# EasyEDA Pro project OctoSlime_TouchPad_Led_Mount.eprj

# Schematic Schematic1
Create Date: 2022-09-05; Page Name: P1; Project Name: OctoSlime_TouchPad_Led_Mount; Schematic Name: Schematic1; Update Date: 2022-09-05
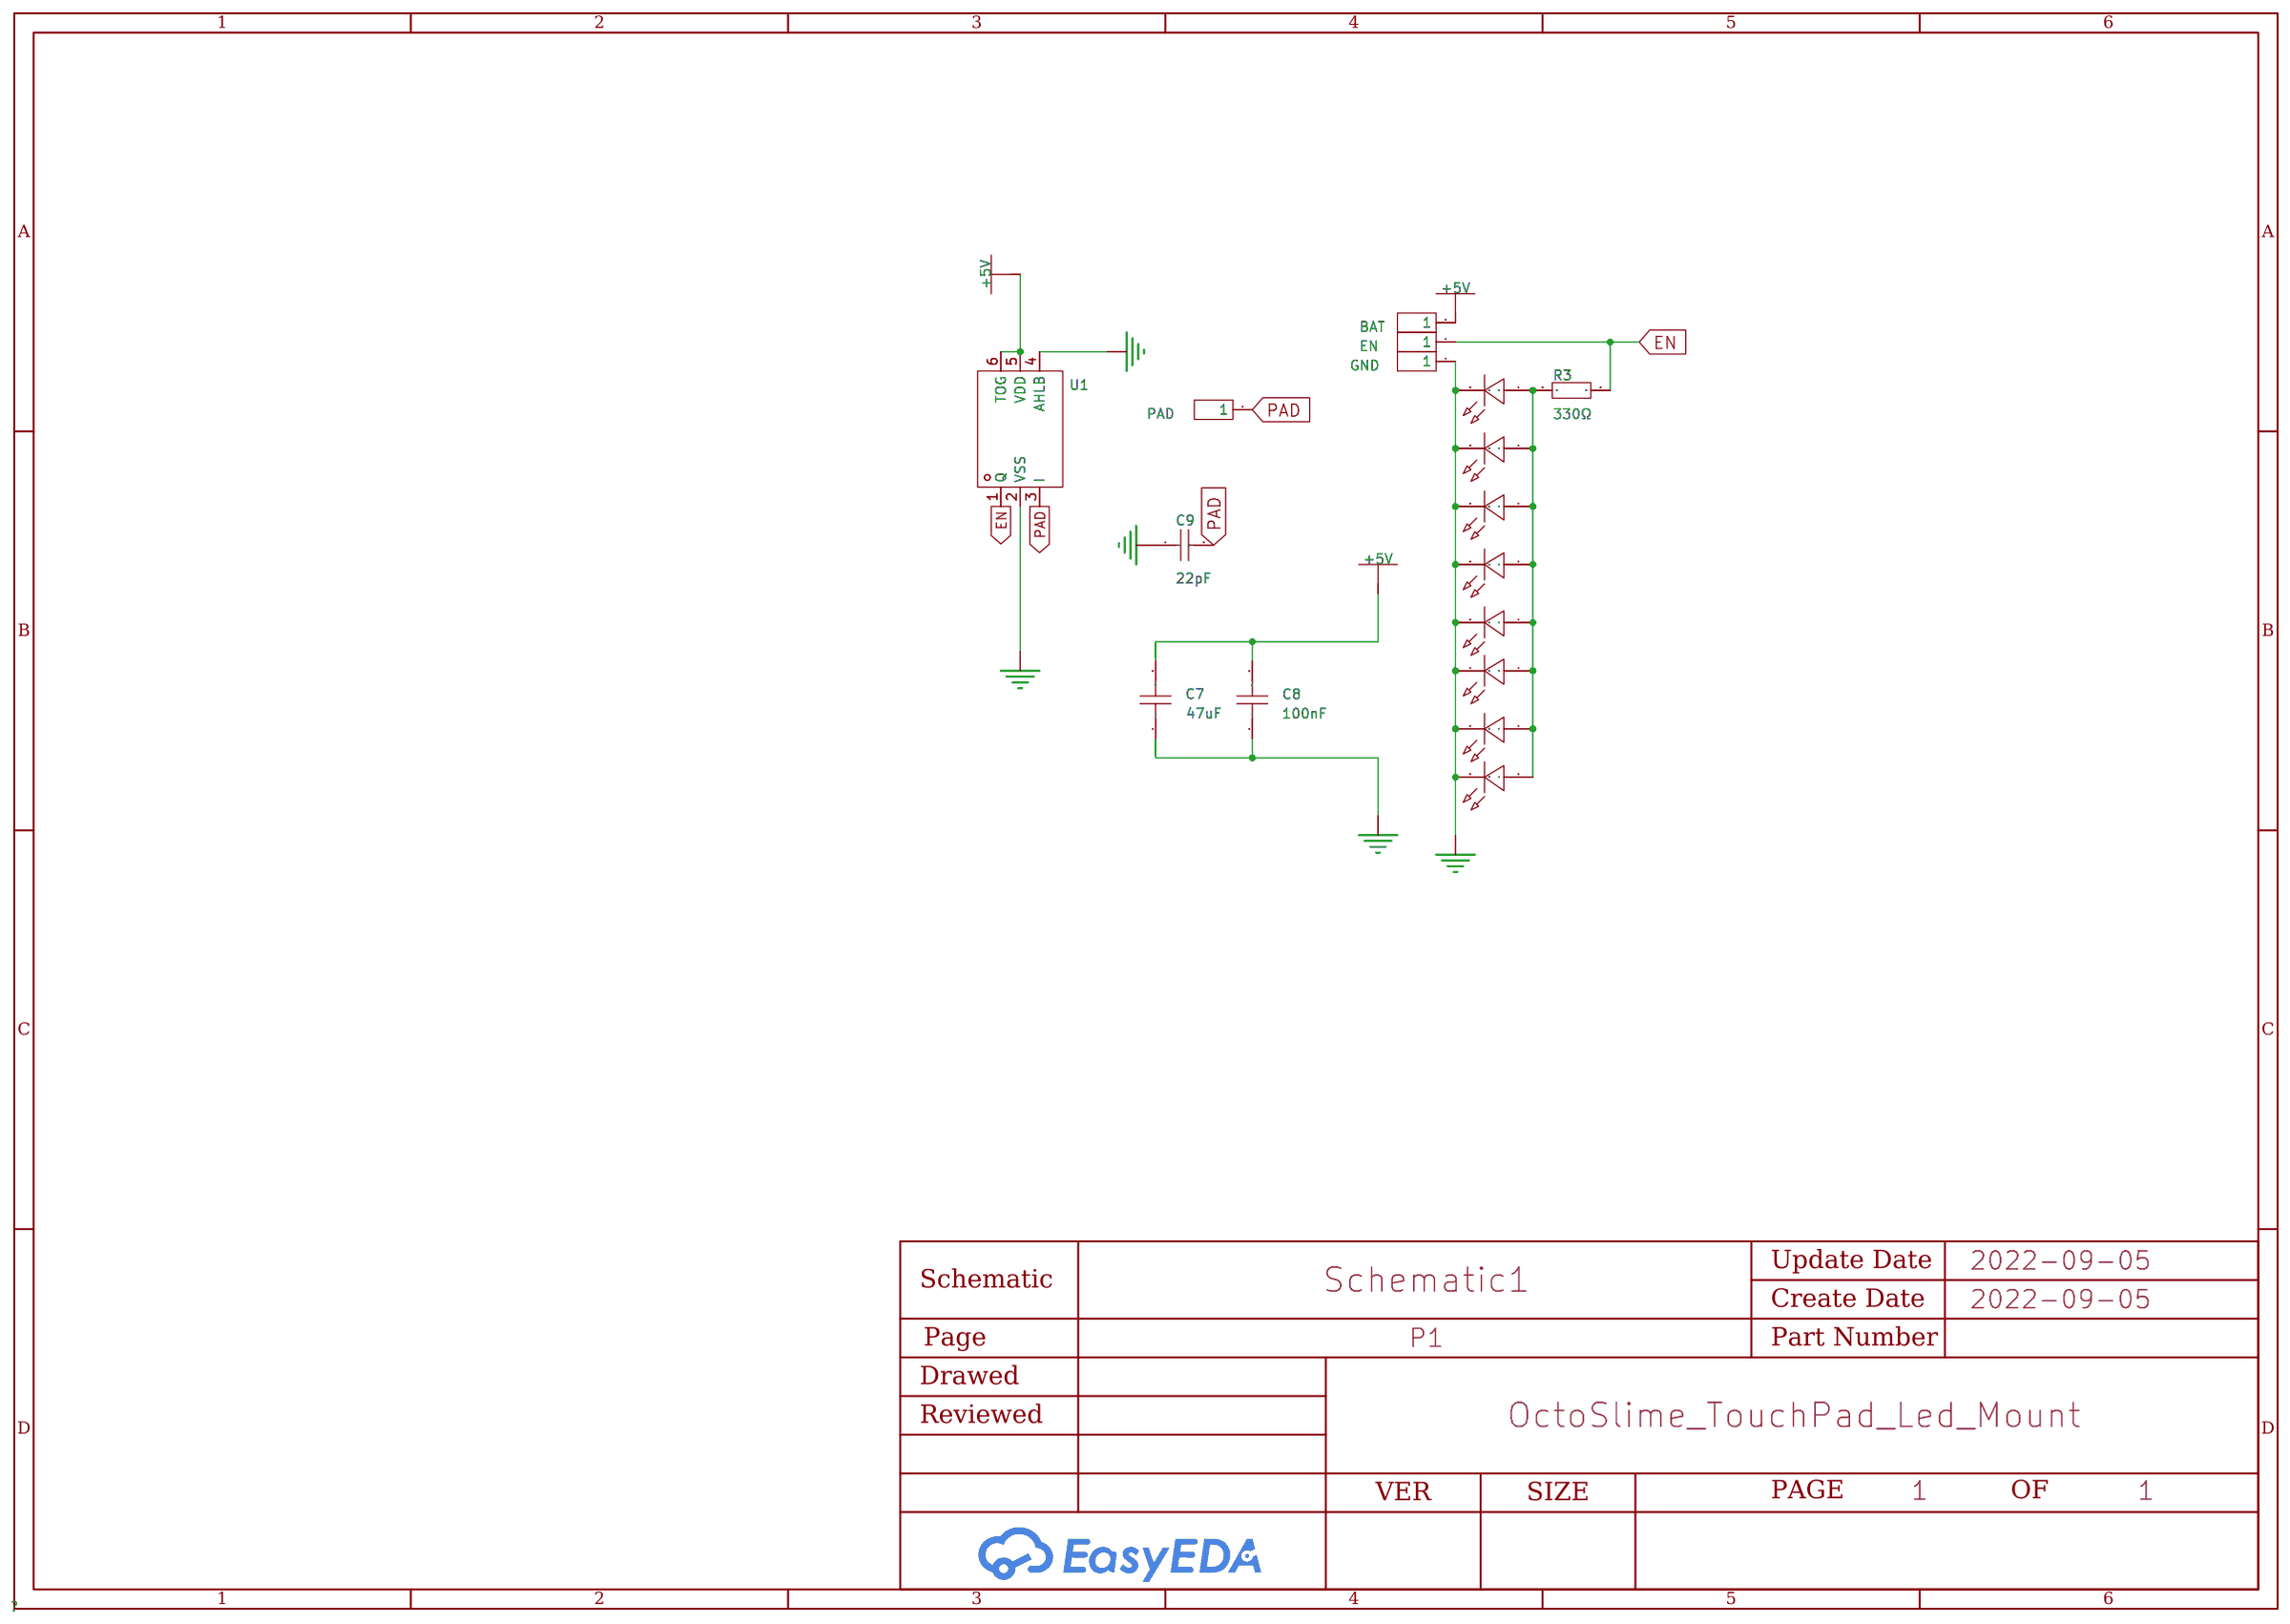
[diagram p0: schematic sheet]

## Parts
BAT  -  [HDR-TH_1P-P2.54-V-M]  (no BOM)
C7  47uF  [C1206]
C8  100nF  [C0402]
C9  22pF  [C0805]
EN  -  [HDR-TH_1P-P2.54-V-M]  (no BOM)
GND  -  [HDR-TH_1P-P2.54-V-M]  (no BOM)
LED5  LED-0805_B  [LED0805_BLUE]
LED6  LED-0805_B  [LED0805_BLUE]
LED7  LED-0805_B  [LED0805_BLUE]
LED8  LED-0805_B  [LED0805_BLUE]
LED9  LED-0805_B  [LED0805_BLUE]
LED10  LED-0805_B  [LED0805_BLUE]
LED11  LED-0805_B  [LED0805_BLUE]
LED12  LED-0805_B  [LED0805_BLUE]
PAD  -  [HDR-TH_1P-P2.54-V-M]  (no BOM)
R3  330Ω  [R0805]
U1  -  [SOT-23-6_L2.9-W1.6-P0.95-LS2.8-BR]  (no BOM)

## Library data of the parts
BAT EN GND PAD = 2.54-1*1P针: 间距:-;总PIN位数:1;排数:1;插针结构:-;行距:-;安装类型:直插;圆针/方针:-;额定电流:-;额定电压:-;配合针长度:-;塑高:-;触头材质:-;触头镀层:-;颜色:黑色;; LCSC Part Name: 1x1P; Supplier Part: C81276; Manufacturer: BOOMELE(博穆精密); Supplier Footprint: 插件; JLCPCB Part Class: Extended Part; Supplier: LCSC; Number of Pins: 1; Number of Rows: 1; Mounting Type: 直插; Color: 黑色; LCSC On Sale: 1; JLCPCB On Sale: 1; Type: 直插; Connector Type: 排针
C7 = CL31A476MPHNNNE: 容值:47uF;精度:±20%;额定电压:10V;温度系数:X5R;; LCSC Part Name: 47uF ±20% 10V; Supplier Part: C96123; Manufacturer: SAMSUNG(三星); Supplier Footprint: 1206; JLCPCB Part Class: Basic Part; Datasheet: https://atta.szlcsc.com/upload/public/pdf/source/20170228/1488267692219.pdf; Supplier: LCSC; Tolerance: ±20%; Voltage Rated: 10V; Temperature Coefficient: X5R
C8 = CL05B104KB54PNC: 容值:100nF;精度:±10%;额定电压:50V;温度系数:X7R;; LCSC Part Name: 100nF ±10% 50V; Supplier Part: C307331; Manufacturer: SAMSUNG(三星); Supplier Footprint: 0402; JLCPCB Part Class: Basic Part; Datasheet: https://atta.szlcsc.com/upload/public/pdf/source/20181009/C307331_222F7C870FD3EA5F46F538B483443886.pdf; Supplier: LCSC; Tolerance: ±10%; Voltage Rated: 50V; Temperature Coefficient: X7R
C9 = CL21C220JBANNNC: 容值:22pF;精度:±5%;额定电压:50V;温度系数:C0G;; LCSC Part Name: 22pF ±5% 50V; Supplier Part: C1804; Manufacturer: SAMSUNG(三星); Supplier Footprint: 0805; JLCPCB Part Class: Basic Part; Datasheet: https://atta.szlcsc.com/upload/public/pdf/source/20160103/1457707697973.pdf; Supplier: LCSC; Tolerance: ±5%; Voltage Rated: 50V; Temperature Coefficient: C0G
LED5-LED12 = LED-0805_B: 3DModel: LED0805_Blue; Manufacturer: 方舟 ARKLED; Manufacturer Part: D-B080508B1-KS2; Supplier Part: C108412
R3 = 0805W8F3300T5E: 电阻类型:厚膜电阻;阻值:330Ω;精度:±1%;功率:125mW;温度系数:±100ppm/;最大工作电压:150V;工作温度范围:-55~+155;; LCSC Part Name: 330Ω ±1%; Supplier Part: C17630; Manufacturer: UNI-ROYAL(厚声); Supplier Footprint: 0805; JLCPCB Part Class: Basic Part; Datasheet: https://atta.szlcsc.com/upload/public/pdf/source/20200306/C422600_1E6D84923E4A46A82E41ADD87F860B5C.pdf; Supplier: LCSC; Type: 厚膜电阻; Tolerance: ±1%; Power(Watts): 125mW; Temperature Coefficient: ±100ppm/; Overload Voltage (Max): 150V; Operating Temperature Range: -55~+155
U1 = TTP223E-BA6: 单按键触摸感应开关; LCSC Part Name: TTP223E-BA6 停产; Supplier Part: C129457; Manufacturer: TONTEK(台湾通泰); Supplier Footprint: SOT-23-6; JLCPCB Part Class: Extended Part; Datasheet: https://atta.szlcsc.com/upload/public/pdf/source/20170914/C129457_1505360037116968239.pdf; Supplier: LCSC

## Nets
+5V: BAT.1 C7.2 C8.2 U1.5(VDD) U1.6(TOG)
GND: C7.1 C8.1 C9.1 GND.1 LED5.2 LED6.2 LED7.2 LED8.2 LED9.2 LED10.2 LED11.2 LED12.2 U1.2(VSS) U1.4(AHLB)
EN: EN.1 R3.1 U1.1(Q)
NET2: LED5.1 LED6.1 LED7.1 LED8.1 LED9.1 LED10.1 LED11.1 LED12.1 R3.2
PAD: C9.2 PAD.1 U1.3(I)

# Board PCB1
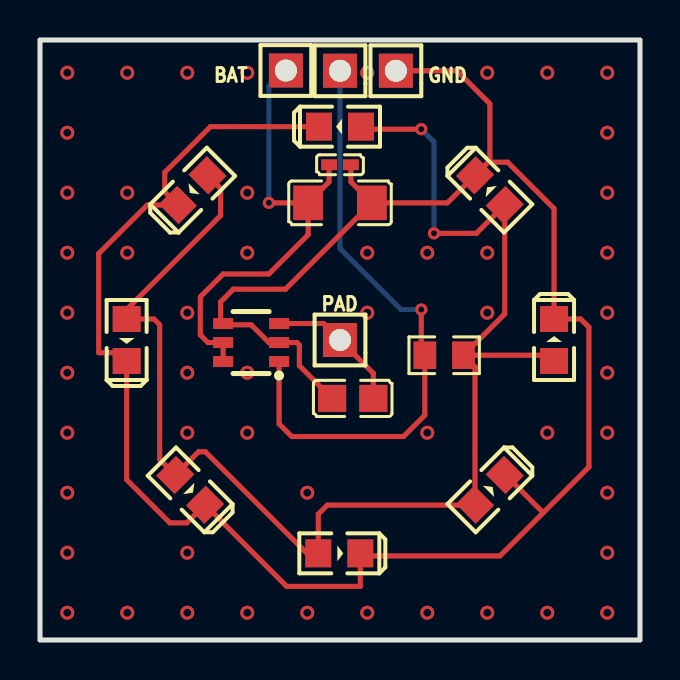
[diagram p1: board, top side]
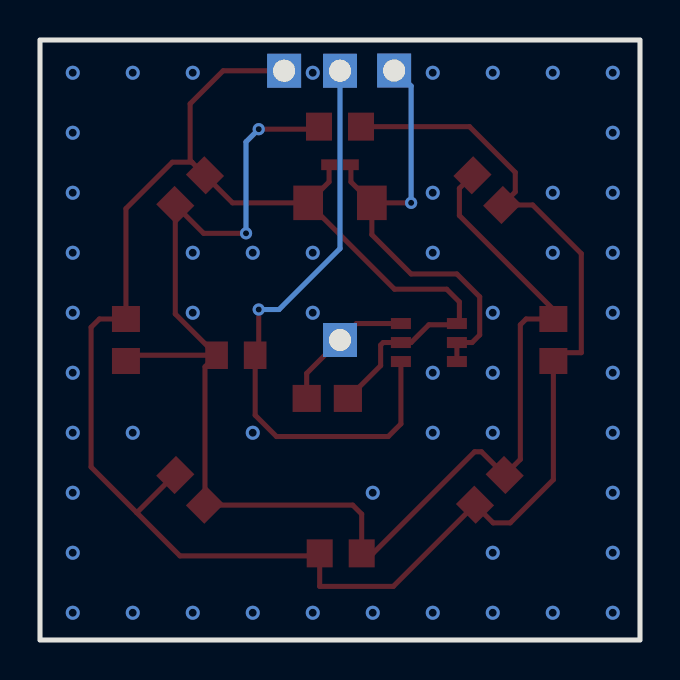
[diagram p2: board, bottom side, seen from below]

Outline 30 x 30 mm; copper layers: Top Layer, Bottom Layer. Coordinates in mm from the lower left corner of the outline.
Outline path: rectangle 0,30 30,0
Stack: Top Layer 0.035mm / Dielectric1 1.51mm FR4 er 4.5 / Bottom Layer 0.035mm

## Design rules (mm)
spacing safeClearance (default): track to track 0.152, other pairs 0.152 to 0.3
track width trackWidth (default): min 0.127, default 0.254, max 2.54
differential pair differentialPair (default): width min 0.127, default 0.254, max 2.54; gap min 0.152, default 0.152
via viaSize (default): diameter min 0.5, default 0.61, max 10; hole min 0.3, default 0.305, max 6

## Placement (name value [footprint] x y rotation side)
BAT  -  [HDR-TH_1P-P2.54-V-M]  12.29 28.47 0 top
C7  47uF  [C1206]  15 21.86 180 top
C8  100nF  [C0402]  15 23.76 180 top
C9  22pF  [C0805]  15.63 12.08 0 top
EN  -  [HDR-TH_1P-P2.54-V-M]  15 28.46 0 top
GND  -  [HDR-TH_1P-P2.54-V-M]  17.79 28.46 0 top
LED5  LED-0805_B  [LED0805_BLUE]  4.33 15 270 top
LED6  LED-0805_B  [LED0805_BLUE]  22.49 7.51 45 top
LED7  LED-0805_B  [LED0805_BLUE]  25.7 15 90 top
LED8  LED-0805_B  [LED0805_BLUE]  22.49 22.49 135 top
LED9  LED-0805_B  [LED0805_BLUE]  15 25.67 180 top
LED10  LED-0805_B  [LED0805_BLUE]  7.51 7.51 315 top
LED11  LED-0805_B  [LED0805_BLUE]  7.63 22.49 225 top
LED12  LED-0805_B  [LED0805_BLUE]  14.97 4.33 0 top
PAD  -  [HDR-TH_1P-P2.54-V-M]  15 15 0 top
R3  330Ω  [R0805]  20.21 14.24 0 top
U1  -  [SOT-23-6_L2.9-W1.6-P0.95-LS2.8-BR]  10.56 14.87 0 top

## Footprints (pads in the part's own frame, mm; a bottom-side part is the same pattern mirrored in y, then rotated)
C0402
  rect 0.79x0.541 smd: 1(-0.546,0) 2(0.546,0)
C0805
  rect 1.409x1.351 smd: 1(-1.028,0) 2(1.031,0)
C1206
  rect 1.486x1.727 smd: 1(-1.593,0) 2(1.593,0)
HDR-TH_1P-P2.54-V-M
  rect 1.7x1.7 hole 1.1: 1(0,0)
LED0805_BLUE
  rect 1.3x1.399 smd: 1(-1.05,0) 2(1.05,0)
R0805
  rect 1.133x1.377 smd: 1(-0.965,0) 2(0.965,0)
SOT-23-6_L2.9-W1.6-P0.95-LS2.8-BR
  rect 1.001x0.551 smd: 1(1.399,-0.95) 2(1.399,0) 3(1.399,0.95) 4(-1.399,0.95) 5(-1.399,0) 6(-1.399,-0.95)

## Nets
As in the schematic.

## Via types
v1: diameter 0.61, hole 0.305, Top Layer to Bottom Layer, 4 vias
v2: diameter 0.7, hole 0.4, Top Layer to Bottom Layer, 52 vias

## Routing (per net, layer and track width the routed paths; a pad name or vN(x,y) marks a point on that pad's centre or on a via; arc(x,y) is an arc through that point)
+5V: length 23.6
  Top Layer w0.254: v1(11.44,21.86) C7.2 ; C7.2 14.45,22.9 C8.2 ; C7.2 13.41,20.27 11.44,18.3 9.16,18.3 8.01,17.16 8.01,15.25 8.4,14.87 U1.5 U1.6
  Bottom Layer w0.254: 12.21,28.46 11.44,27.7 v1(11.44,21.86)
GND: length 114.7
  Top Layer w0.254: 25.16,6.36 27.45,8.65 27.45,15.64 27.03,16.05 LED7.2 25.7,21.57 23.38,23.89 22.4,23.89 ; 25.16,6.36 23,4.2 16.14,4.2 LED12.2 16.02,2.68 12.33,2.68 LED10.2 7.34,5.86 6.49,5.86 4.33,8.02 LED5.2 3.92,14.36 2.94,14.36 2.94,19.32 5.37,21.75 LED11.2 6.24,22.4 6.24,23.38 8.52,25.67 LED9.2 ; 25.16,6.36 23.27,8.25 LED6.2 ; C7.1 20.37,21.86 22.4,23.89 ; C7.1 15.55,22.9 C8.1 ; C7.1 12.27,17.54 9.67,17.54 9.03,16.91 9.03,15.95 9.22,15.76 10.56,15.76 11.44,14.87 U1.2 12.84,14.87 12.97,14.75 12.97,13.72 C9.1 ; 22.4,23.89 22.49,23.98 22.49,26.81 20.84,28.46 GND.1
  vias: v2(1.36,28.36) v2(1.36,25.36) v2(1.36,22.36) v2(1.36,19.36) v2(1.36,16.36) v2(1.36,13.36) v2(1.36,10.36) v2(1.36,7.36) v2(1.36,4.36) v2(1.36,1.36) v2(4.36,28.36) v2(4.36,22.36) v2(4.36,19.36) v2(4.36,1.36) v2(7.36,28.36) v2(7.36,16.36) v2(7.36,13.36) v2(7.36,10.36) v2(7.36,4.36) v2(7.36,1.36) v2(10.36,28.36) v2(10.36,22.36) v2(10.36,19.36) v2(10.36,13.36) v2(10.36,10.36) v2(10.36,1.36) v2(13.36,7.36) v2(13.36,1.36) v2(16.36,28.36) v2(16.36,19.36) v2(16.36,16.36) v2(16.36,1.36) v2(19.36,19.36) v2(19.36,10.36) v2(19.36,1.36) v2(22.36,28.36) v2(22.36,19.36) v2(22.36,16.36) v2(22.36,1.36) v2(25.36,28.36) v2(25.36,10.36) v2(25.36,1.36) v2(28.36,28.36) v2(28.36,25.36) v2(28.36,22.36) v2(28.36,19.36) v2(28.36,16.36) v2(28.36,13.36) v2(28.36,10.36) v2(28.36,7.36) v2(28.36,4.36) v2(28.36,1.36)
EN: length 30.7
  Top Layer w0.254: U1.1 11.95,10.81 12.59,10.17 18.18,10.17 19.24,11.24 R3.1 19.06,14.42 v1(19.06,16.52)
  Bottom Layer w0.254: v1(19.06,16.52) 18.05,16.52 15,19.57 EN.1
NET2: length 72.1
  Top Layer w0.254: R3.2 23.24,16.3 LED8.1 21.82,20.33 v1(19.7,20.33) ; R3.2 21.75,13.66 LED6.1 21.73,6.75 14.37,6.75 13.92,6.3 LED12.1 13.35,4.33 8.27,9.41 7.93,9.41 LED10.1 5.98,9.03 5.98,15.76 5.69,16.05 LED5.1 4.33,16.52 9.03,21.22 9.03,22.58 LED11.1 ; R3.2 25.41,14.24 LED7.1 ; LED9.1 16.18,25.54 v1(19.06,25.54)
  Bottom Layer w0.254: v1(19.06,25.54) 19.7,24.91 v1(19.7,20.33)
PAD: length 7
  Top Layer w0.254: U1.3 14.18,15.82 PAD.1 16.67,13.33 C9.2

## Copper pours and planes (outline as drawn; the poured copper is in the pictures)
GND on Top Layer: -1.64,31.26 31.38,31.26 31.38,-1.64 -1.64,-1.64
GND on Bottom Layer: -0.88,30.62 30.88,30.62 30.88,-0.88 -0.88,-0.88
